# Altium schematic sheet CW308T_CEC1702_UFO.SchDoc: CEC1702 Target Pin Connections
size Letter; Organization: NewAE Technology Inc.; Address1: 1083 Queen St., Suite 196; Address2: Halifax; Address3: NS; Address4: Canada B3H 0B2; DocumentNumber: 2; SheetNumber: 2; SheetTotal: 2; SheetApproved: YES
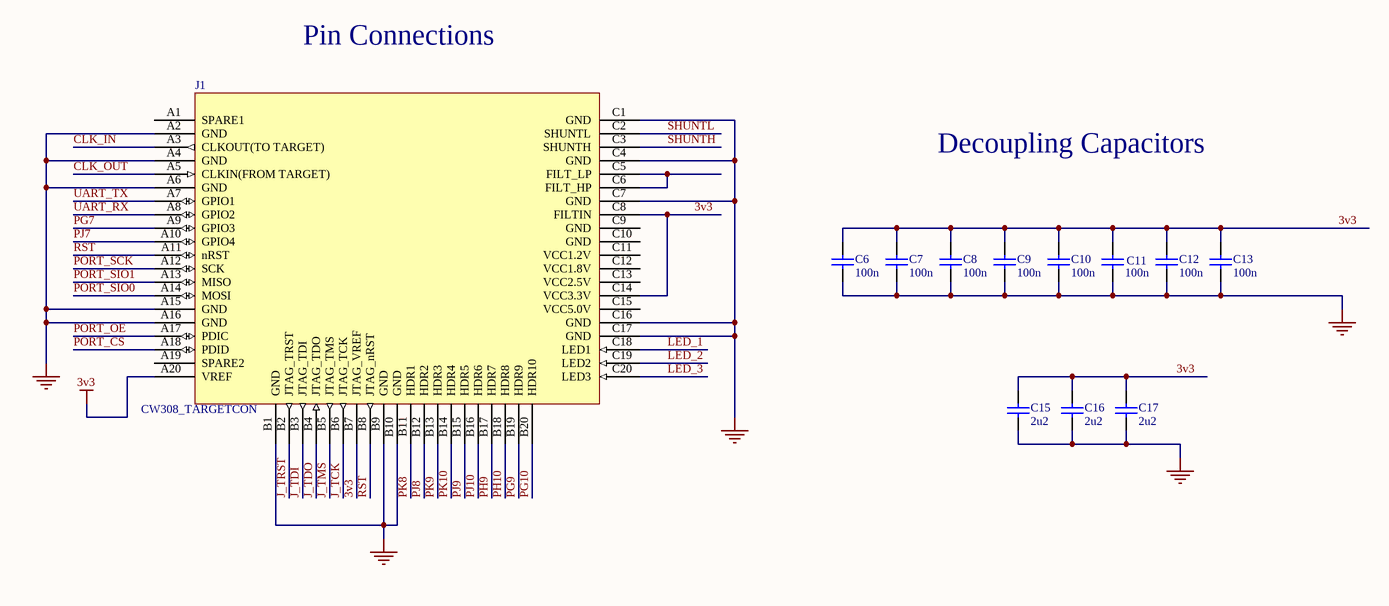
[diagram p0: CW308T_CEC1702_UFO.SchDoc]

## Parts
C6  100n  [CAPC0603_M]
C7  100n  [CAPC0603_M]
C8  100n  [CAPC0603_M]
C9  100n  [CAPC0603_M]
C10  100n  [CAPC0603_M]
C11  100n  [CAPC0603_M]
C12  100n  [CAPC0603_M]
C13  100n  [CAPC0603_M]
C15  2u2  [CAPC0603_M]
C16  2u2  [CAPC0603_M]
C17  2u2  [CAPC0603_M]
J1  CW308_TARGETCON  [CW308_TBOARD_CONN]

## Nets
3v3: C6.1 C7.1 C8.1 C9.1 C10.1 C11.1 C12.1 C13.1 C15.1 C16.1 C17.1 J1.A20(VREF) J1.B7(JTAG_VREF) J1.C8(FILTIN) J1.C14(VCC3.3V)
GND: C6.2 C7.2 C8.2 C9.2 C10.2 C11.2 C12.2 C13.2 C15.2 C16.2 C17.2 J1.A2(GND) J1.A4(GND) J1.A6(GND) J1.A15(GND) J1.A16(GND) J1.B1(GND) J1.B9(GND) J1.B10(GND) J1.C1(GND) J1.C4(GND) J1.C7(GND) J1.C16(GND) J1.C17(GND)
CLK_IN: J1.A3(CLKOUT(TO_TARGET))
CLK_OUT: J1.A5(CLKIN(FROM_TARGET))
J_TCK: J1.B6(JTAG_TCK)
J_TDI: J1.B3(JTAG_TDI)
J_TDO: J1.B4(JTAG_TDO)
J_TMS: J1.B5(JTAG_TMS)
J_TRST: J1.B2(JTAG_TRST)
LED_1: J1.C18(LED1)
LED_2: J1.C19(LED2)
LED_3: J1.C20(LED3)
PG7: J1.A9(GPIO3)
PG9: J1.B19(HDR9)
PG10: J1.B20(HDR10)
PH9: J1.B17(HDR7)
PH10: J1.B18(HDR8)
PJ7: J1.A10(GPIO4)
PJ8: J1.B12(HDR2)
PJ9: J1.B15(HDR5)
PJ10: J1.B16(HDR6)
PK8: J1.B11(HDR1)
PK9: J1.B13(HDR3)
PK10: J1.B14(HDR4)
PORT_CS: J1.A18(PDID)
PORT_OE: J1.A17(PDIC)
PORT_SCK: J1.A12(SCK)
PORT_SIO0: J1.A14(MOSI)
PORT_SIO1: J1.A13(MISO)
RST: J1.A11(nRST) J1.B8(JTAG_nRST)
SHUNTH: J1.C3(SHUNTH)
SHUNTL: J1.C2(SHUNTL)
UART_RX: J1.A8(GPIO2)
UART_TX: J1.A7(GPIO1)
NetJ1_C5: J1.C5(FILT_LP) J1.C6(FILT_HP)

Not connected (* = marked no-connect by the designer): J1 A1(SPARE1) A19(SPARE2) C9(GND) C10(GND) C11(VCC1.2V) C12(VCC1.8V) C13(VCC2.5V) C15(VCC5.0V)

## Notes on the sheet
- Pin Connections
- Decoupling Capacitors
- Title:
- Date:
- Rev:
- Time:
- Project:
- Sheet
- of
- License:
- Copyright © NewAE Technology Inc.
- Approved:
- NewAE.com
- File:

## Library data of the parts
C6-C13 = CCHIP-100n-0603: 100n, 0603; Manufacture 1: Kemet; Manufacture Part Number 1: C0603C104K5RACTU; Component Group: Capacitor; Case-EIA: 0603; Case-Metric: 1608; Rated Voltage: 50V; Part Number: CCHIP-100n-0603; Footprint: 0603; Pin Count: 2; Supplier 1: Digi-Key; Supplier Part Number 1: 399-5089-2-ND; Value: 100n; Mounting Technology: SMT; Component Kind: Standard; Component Type: Standard
C15-C17 = CCHIP-2u2-0603: 2u2, 0603; Manufacture 1: Samsung; Manufacture Part Number 1: CL10B225KP8NNNC; Component Group: Capacitor; Case-EIA: 0603; Case-Metric: 1608; Part Number: CCHIP-2u2-0603; Footprint: 0603; Pin Count: 2; Supplier 1: Digi-Key; Supplier Part Number 1: 1276-1134-2-ND; Value: 2u2; Mounting Technology: SMT; Component Kind: Standard; Component Type: Standard
J1 = CW308_TBOARD: CW308 "Standard" Target Board Connector; Component Group: Mechanical; Pitch: 2.54mm; Part Number: CW308_TBOARD; Pin Count: 60; Mounting Technology: Through-hole; Component Kind: Standard; Component Type: Standard